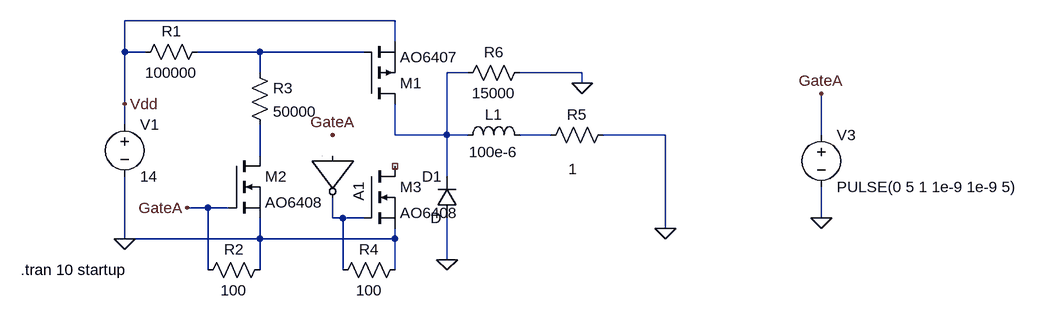
[diagram p0: schematic P-MOSFET_MotorDrive3.asc]
P-MOSFET_MotorDrive3.asc, the LTspice schematic file:
Version 4
SHEET 1 1624 680
WIRE 192 48 -224 48
WIRE 192 80 192 48
WIRE -224 96 -224 48
WIRE -192 96 -224 96
WIRE -16 96 -112 96
WIRE 144 96 -16 96
WIRE -16 128 -16 96
WIRE 304 128 272 128
WIRE 480 128 384 128
WIRE 480 144 480 128
WIRE -224 176 -224 96
WIRE -224 208 -224 176
WIRE 192 224 192 176
WIRE 272 224 272 128
WIRE 272 224 192 224
WIRE 304 224 272 224
WIRE 432 224 384 224
WIRE 608 224 512 224
WIRE 848 224 848 160
WIRE -16 256 -16 208
WIRE 272 288 272 224
WIRE -96 336 -128 336
WIRE -64 336 -96 336
WIRE 96 352 96 320
WIRE 112 352 96 352
WIRE 144 352 112 352
WIRE 848 352 848 304
WIRE 608 368 608 224
WIRE -224 384 -224 288
WIRE -16 384 -16 352
WIRE -16 384 -224 384
WIRE 192 384 192 368
WIRE 192 384 -16 384
WIRE 272 416 272 352
WIRE -96 432 -96 336
WIRE -16 432 -16 384
WIRE 112 432 112 352
WIRE 192 432 192 384
FLAG -224 384 0
FLAG 848 352 0
FLAG 848 160 GateA
FLAG 96 224 GateA
FLAG -224 176 Vdd
FLAG -128 336 GateA
FLAG 608 368 0
FLAG 272 416 0
FLAG 480 144 0
SYMBOL pmos 144 176 M180
SYMATTR InstName M1
SYMATTR Value AO6407
SYMBOL voltage -224 192 R0
WINDOW 123 0 0 Left 0
WINDOW 39 0 0 Left 0
SYMATTR InstName V1
SYMATTR Value 14
SYMBOL res -96 80 R90
WINDOW 0 0 56 VBottom 2
WINDOW 3 32 56 VTop 2
SYMATTR InstName R1
SYMATTR Value 100000
SYMBOL voltage 848 208 R0
WINDOW 123 0 0 Left 0
WINDOW 39 0 0 Left 0
SYMATTR InstName V3
SYMATTR Value PULSE(0 5 1 1e-9 1e-9 5)
SYMBOL res -32 112 R0
SYMATTR InstName R3
SYMATTR Value 50000
SYMBOL Digital\\inv 160 256 R90
SYMATTR InstName A1
SYMATTR SpiceLine Vhigh=5
SYMBOL nmos -64 256 R0
SYMATTR InstName M2
SYMATTR Value AO6408
SYMBOL res 0 416 R90
WINDOW 0 0 56 VBottom 2
WINDOW 3 32 56 VTop 2
SYMATTR InstName R2
SYMATTR Value 100
SYMBOL res 208 416 R90
WINDOW 0 0 56 VBottom 2
WINDOW 3 32 56 VTop 2
SYMATTR InstName R4
SYMATTR Value 100
SYMBOL res 528 208 R90
WINDOW 0 0 56 VBottom 2
WINDOW 3 53 62 VTop 2
SYMATTR InstName R5
SYMATTR Value 1
SYMBOL ind 288 240 R270
WINDOW 0 32 56 VTop 2
WINDOW 3 5 56 VBottom 2
SYMATTR InstName L1
SYMATTR Value 100e-6
SYMBOL diode 288 352 R180
WINDOW 0 24 64 Left 2
WINDOW 3 24 0 Left 2
SYMATTR InstName D1
SYMBOL res 400 112 R90
WINDOW 0 0 56 VBottom 2
WINDOW 3 32 56 VTop 2
SYMATTR InstName R6
SYMATTR Value 15000
SYMBOL nmos 144 272 R0
SYMATTR InstName M3
SYMATTR Value AO6408
TEXT -384 432 Left 2 !.tran 10 startup

The netlist it stands for:
* P-MOSFET_MotorDrive3.asc
M1 N002 N001 Vdd Vdd AO6407
V1 Vdd 0 14
R1 N001 Vdd 100000
V3 GateA 0 PULSE(0 5 1 1e-9 1e-9 5)
R3 N001 N004 50000
A1 0 0 0 0 0 N005 0 0 BUF Vhigh=5
M2 N004 GateA 0 0 AO6408
R2 0 GateA 100
R4 0 N005 100
R5 0 N003 1
L1 N002 N003 100e-6
D1 0 N002 D
R6 0 N002 15000
M3 NC_01 N005 0 0 AO6408
.model D D
.lib standard.dio
.model NMOS NMOS
.model PMOS PMOS
.lib standard.mos
.tran 10 startup
.backanno
.end